# Altium schematic sheet CAN_TO_USART_V2.1.SchDoc
size A2
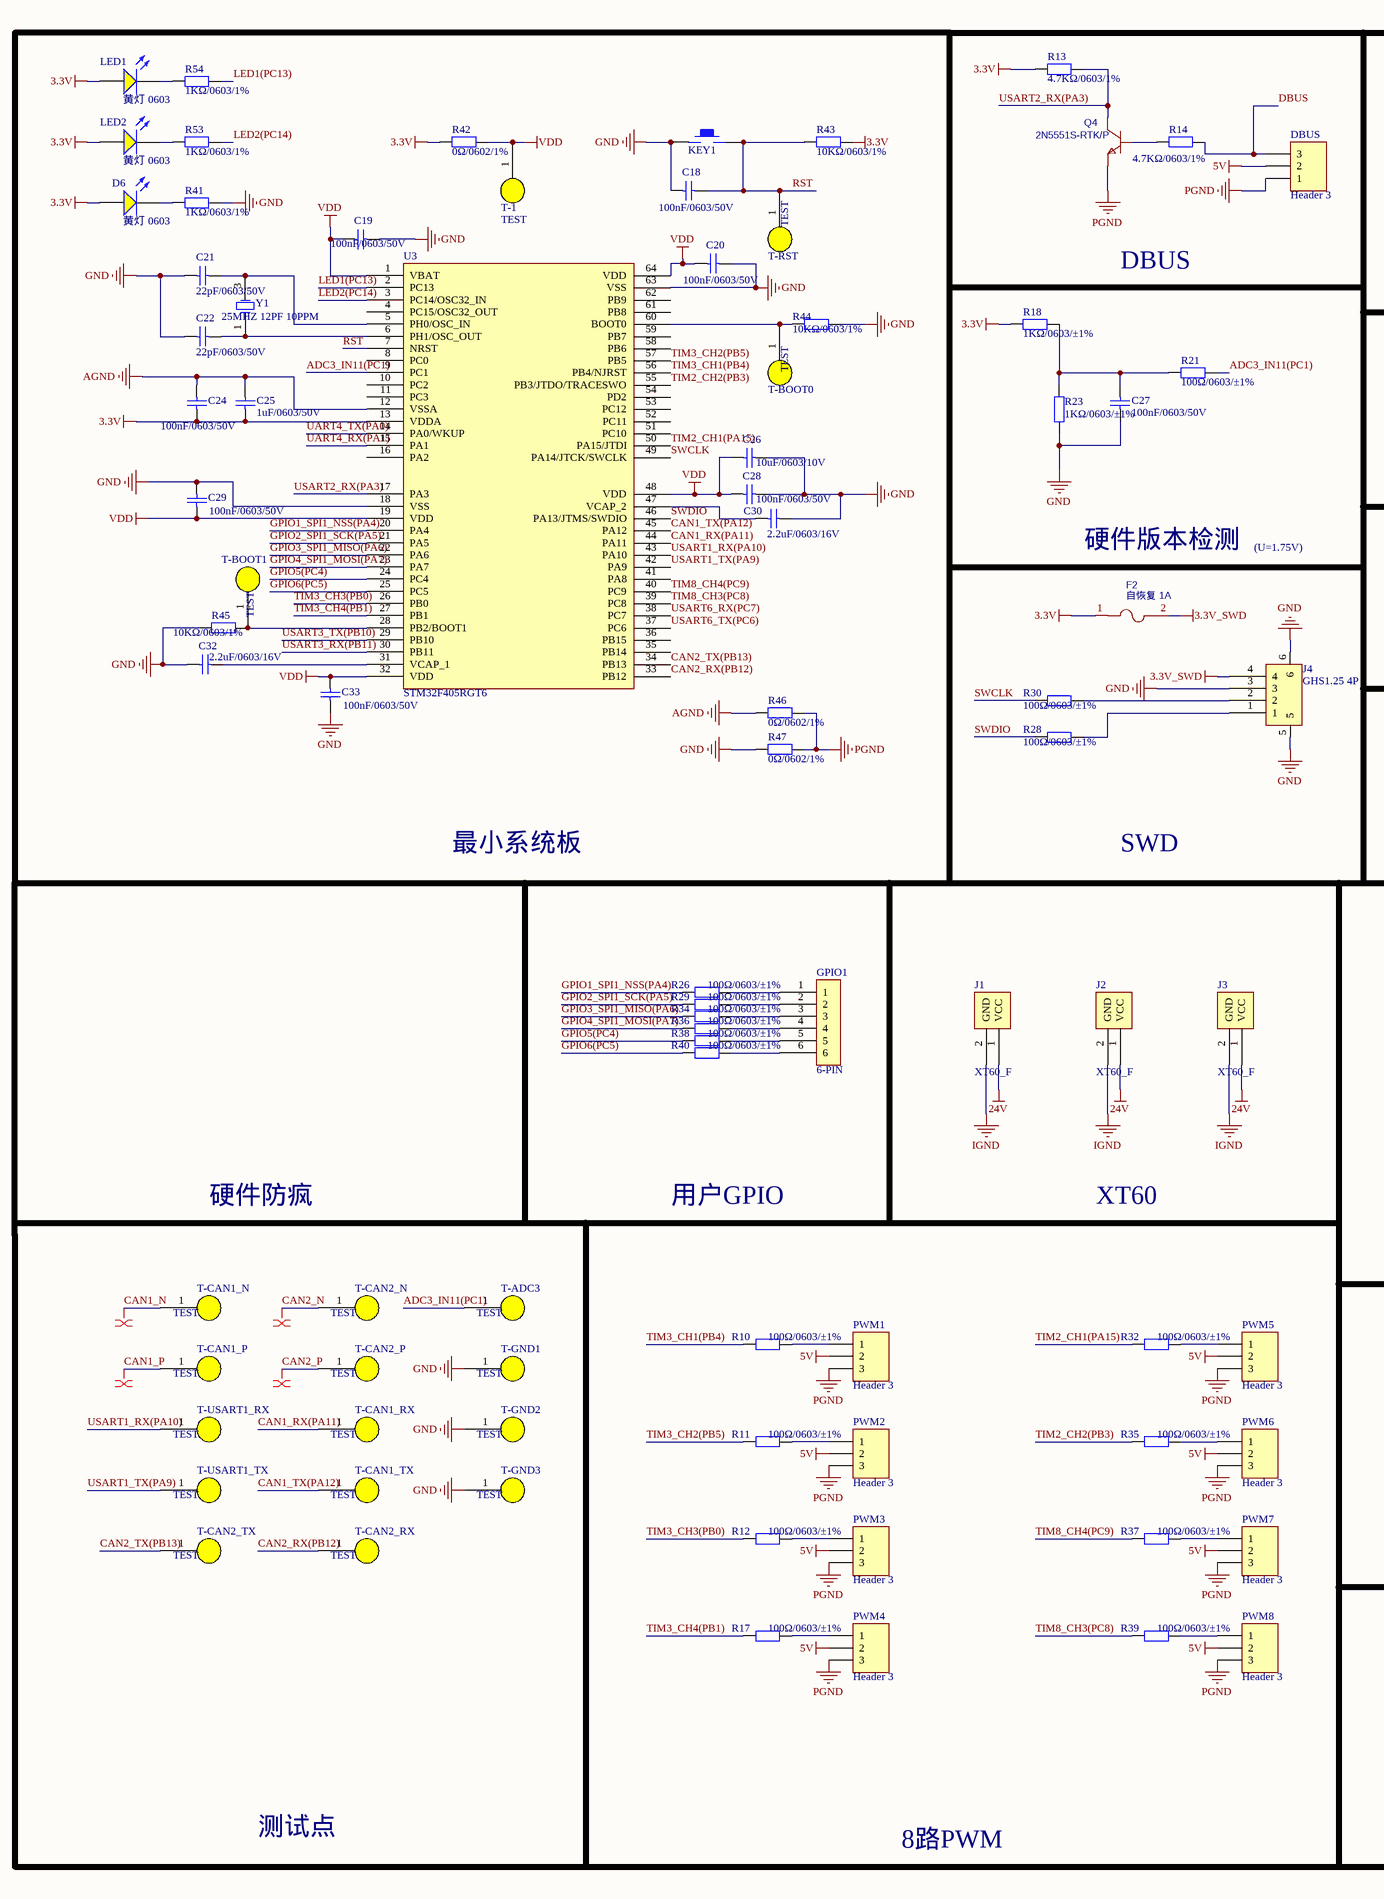
[diagram p0: CAN_TO_USART_V2.1.SchDoc, left]
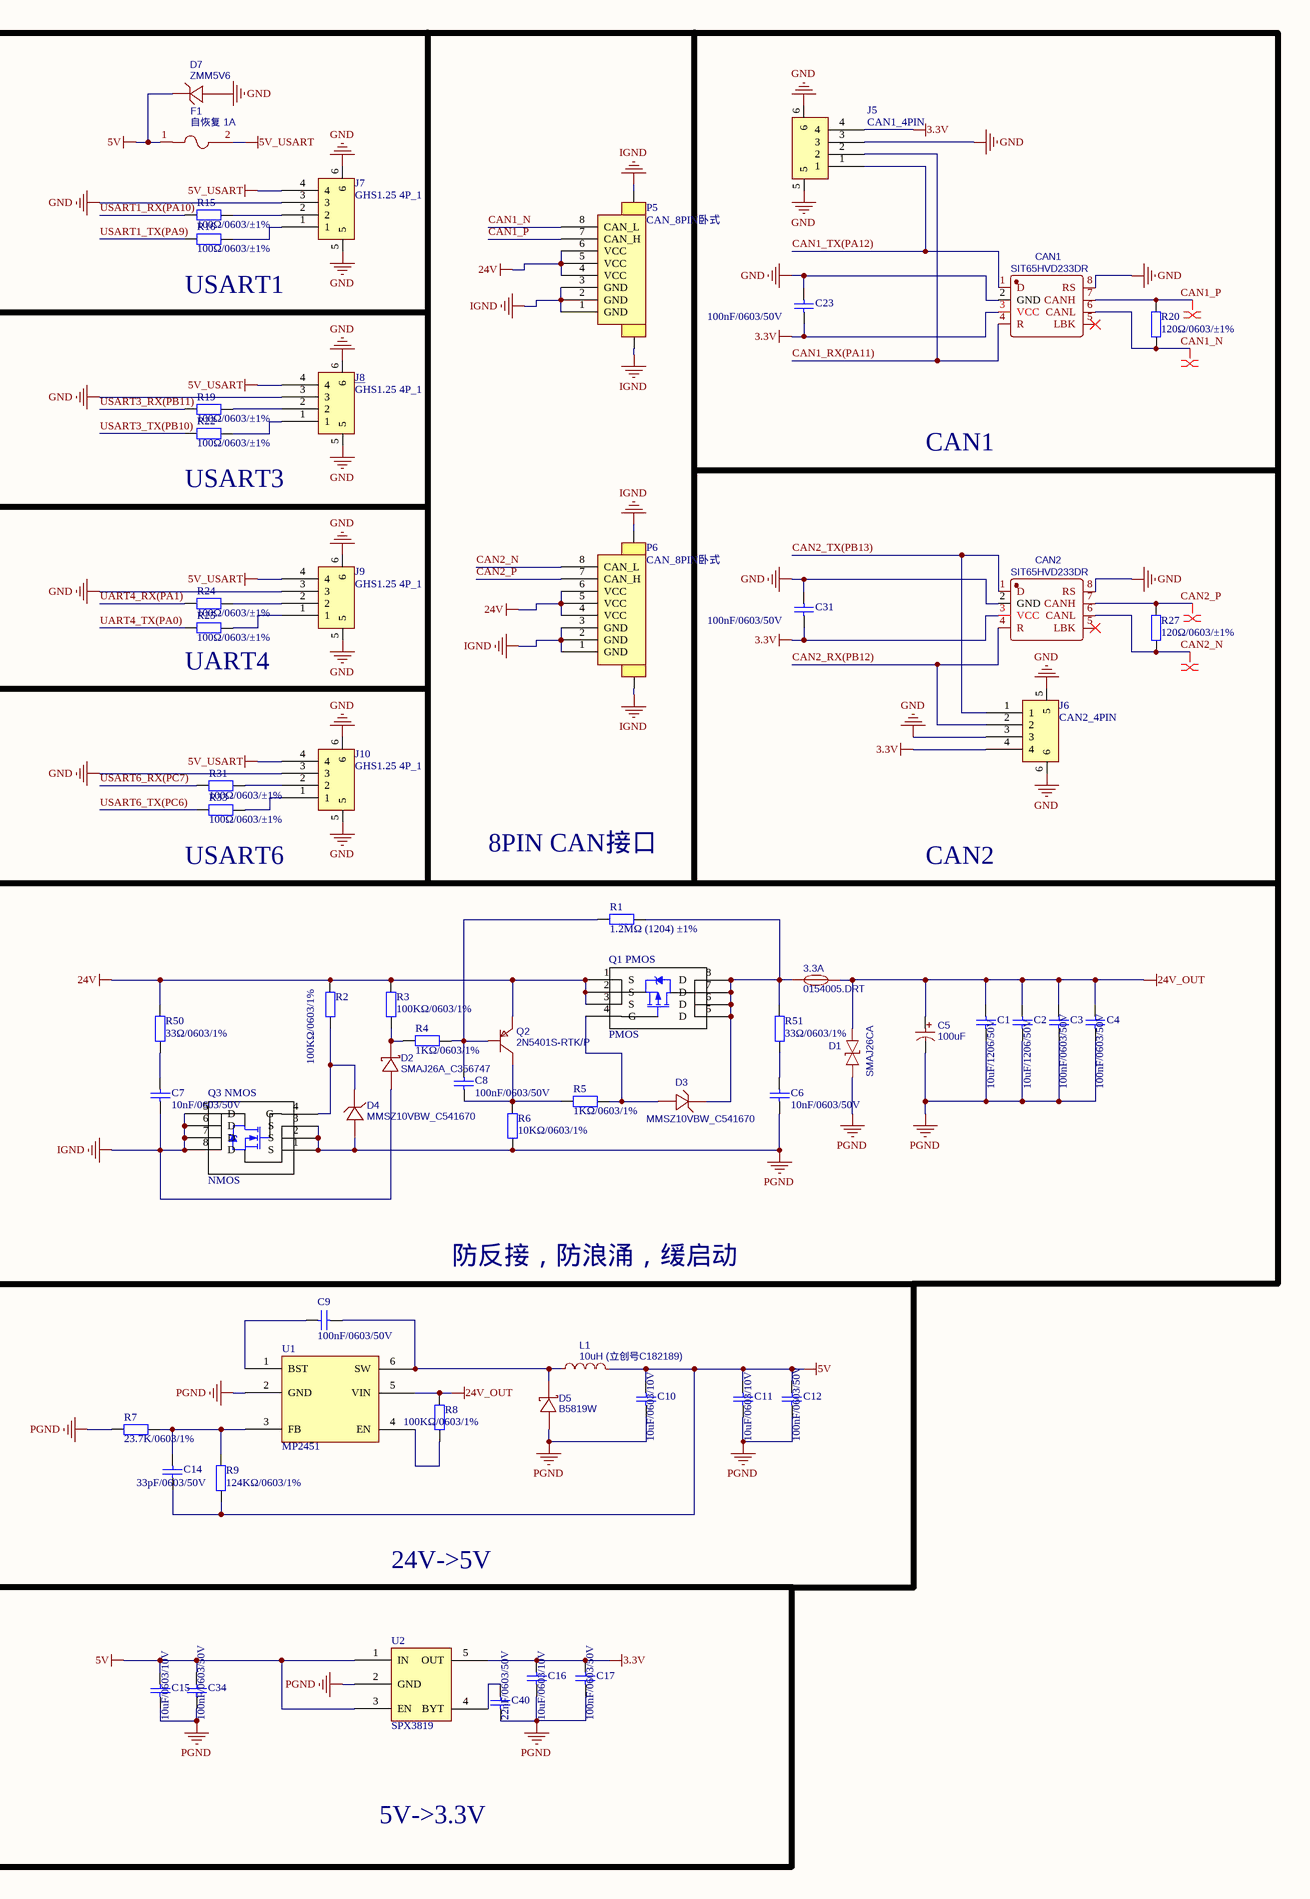
[diagram p1: CAN_TO_USART_V2.1.SchDoc, right]

## Parts
3.3A  0154005.DRT  [FUSE 3.3A]
C1  10uF/1206/50V  [1206_C]
C2  10uF/1206/50V  [1206_C]
C3  100nF/0603/50V  [0603_C]
C4  100nF/0603/50V  [0603_C]
C5  100uF  [100UF E]
C6  10nF/0603/50V  [0603_C]
C7  10nF/0603/50V  [0603_C]
C8  100nF/0603/50V  [0603_C]
C9  100nF/0603/50V  [0603_C]
C10  10uF/0603/10V  [0603_C]
C11  10uF/0603/10V  [0603_C]
C12  100nF/0603/50V  [0603_C]
C14  33pF/0603/50V  [0603_C]
C15  10uF/0603/10V  [0603_C]
C16  10uF/0603/10V  [0603_C]
C17  100nF/0603/50V  [0603_C]
C18  100nF/0603/50V  [0603_C]
C19  100nF/0603/50V  [0603_C]
C20  100nF/0603/50V  [0603_C]
C21  22pF/0603/50V  [0603_C]
C22  22pF/0603/50V  [0603_C]
C23  100nF/0603/50V  [0603_C]
C24  100nF/0603/50V  [0603_C]
C25  1uF/0603/50V  [0603_C]
C26  10uF/0603/10V  [0603_C]
C27  100nF/0603/50V  [0603_C]
C28  100nF/0603/50V  [0603_C]
C29  100nF/0603/50V  [0603_C]
C30  2.2uF/0603/16V  [0603_C]
C31  100nF/0603/50V  [0603_C]
C32  2.2uF/0603/16V  [0603_C]
C33  100nF/0603/50V  [0603_C]
C34  100nF/0603/50V  [0603_C]
C40  22nF/0603/50V  [0603_C]
CAN1  SIT65HVD233DR  [CAN-MCU]
CAN2  SIT65HVD233DR  [CAN-MCU]
D1  SMAJ26CA  [SMAJ26CA]
D2  SMAJ26A_C356747  [SMA_L4.4-W2.8-LS5.4-RD]
D3  MMSZ10VBW_C541670  [SOD-123_L2.7-W1.6-LS3.7-RD]
D4  MMSZ10VBW_C541670  [SOD-123_L2.7-W1.6-LS3.7-RD]
D5  B5819W  [SOD-123_L2.8-W1.8-LS3.7-RD]
D6  黄灯 0603  [0603_LED_S1]
D7  ZMM5V6  [ZMM5.6V]
DBUS  Header 3  [HDR1X3]
F1  自恢复 1A  [1A 0805]
F2  自恢复 1A  [1A 0805]
GPIO1  6-PIN  [6P]
J1  XT60_F  [XT60_F（立式）]
J2  XT60_F  [XT60_F（立式）]
J3  XT60_F  [XT60_F（立式）]
J4  GHS1.25 4P  [SM04B-GHS立式]
J5  CAN1_4PIN  [SM04B-GHS卧式]
J6  CAN2_4PIN  [SM04B-GHS卧式]
J7  GHS1.25 4P_1  [SM04B-GHS卧式]
J8  GHS1.25 4P_1  [SM04B-GHS卧式]
J9  GHS1.25 4P_1  [SM04B-GHS卧式]
J10  GHS1.25 4P_1  [SM04B-GHS卧式]
KEY1  KEY_M  [KEY]  (value not drawn)
L1  10uH (立创号C182189)  [10UH 1A]
LED1  黄灯 0603  [0603_LED_S1]
LED2  黄灯 0603  [0603_LED_S1]
P5  CAN_8PIN卧式  [8Pin]
P6  CAN_8PIN卧式  [8Pin]
PWM1  Header 3  [HDR1X3]
PWM2  Header 3  [HDR1X3]
PWM3  Header 3  [HDR1X3]
PWM4  Header 3  [HDR1X3]
PWM5  Header 3  [HDR1X3]
PWM6  Header 3  [HDR1X3]
PWM7  Header 3  [HDR1X3]
PWM8  Header 3  [HDR1X3]
Q1_PMOS  PMOS  [PMOS TCPA8123]
Q2  2N5401S-RTK/P  [SOT-23-3_L2.9-W1.6-P1.90-LS2.8-TR-CW]
Q3_NMOS  NMOS  [NMOS]
Q4  2N5551S-RTK/P  [SOT-23-3_L2.9-W1.6-P1.90-LS2.8-TR-CW]
R1  1.2MΩ (1204) ±1%  [0603_R]
R2  100KΩ/0603/1%  [0603_R]
R3  100KΩ/0603/1%  [0603_R]
R4  1KΩ/0603/1%  [0603_R]
R5  1KΩ/0603/1%  [0603_R]
R6  10KΩ/0603/1%  [0603_R]
R7  23.7K/0603/1%  [0603_R]
R8  100KΩ/0603/1%  [0603_R]
R9  124KΩ/0603/1%  [0603_R]
R10  100Ω/0603/±1%  [0603_R]
R11  100Ω/0603/±1%  [0603_R]
R12  100Ω/0603/±1%  [0603_R]
R13  4.7KΩ/0603/1%  [0603_R]
R14  4.7KΩ/0603/1%  [0603_R]
R15  100Ω/0603/±1%  [0603_R]
R16  100Ω/0603/±1%  [0603_R]
R17  100Ω/0603/±1%  [0603_R]
R18  1KΩ/0603/±1%  [0603_R]
R19  100Ω/0603/±1%  [0603_R]
R20  120Ω/0603/±1%  [0603_R]
R21  100Ω/0603/±1%  [0603_R]
R22  100Ω/0603/±1%  [0603_R]
R23  1KΩ/0603/±1%  [0603_R]
R24  100Ω/0603/±1%  [0603_R]
R25  100Ω/0603/±1%  [0603_R]
R26  100Ω/0603/±1%  [0603_R]
R27  120Ω/0603/±1%  [0603_R]
R28  100Ω/0603/±1%  [0603_R]
R29  100Ω/0603/±1%  [0603_R]
R30  100Ω/0603/±1%  [0603_R]
R31  100Ω/0603/±1%  [0603_R]
R32  100Ω/0603/±1%  [0603_R]
R33  100Ω/0603/±1%  [0603_R]
R34  100Ω/0603/±1%  [0603_R]
R35  100Ω/0603/±1%  [0603_R]
R36  100Ω/0603/±1%  [0603_R]
R37  100Ω/0603/±1%  [0603_R]
R38  100Ω/0603/±1%  [0603_R]
R39  100Ω/0603/±1%  [0603_R]
R40  100Ω/0603/±1%  [0603_R]
R41  1KΩ/0603/1%  [0603_R]
R42  0Ω/0602/1%  [0603_R]
R43  10KΩ/0603/1%  [0603_R]
R44  10KΩ/0603/1%  [0603_R]
R45  10KΩ/0603/1%  [0603_R]
R46  0Ω/0602/1%  [0603_R]
R47  0Ω/0602/1%  [0603_R]
R50  33Ω/0603/1%  [0603_R]
R51  33Ω/0603/1%  [0603_R]
R53  1KΩ/0603/1%  [0603_R]
R54  1KΩ/0603/1%  [0603_R]
T-1  TEST  [TEST-POINT]
T-ADC3  TEST  [TEST-POINT]
T-BOOT0  TEST  [TEST-POINT]
T-BOOT1  TEST  [TEST-POINT]
T-CAN1_N  TEST  [TEST-POINT]
T-CAN1_P  TEST  [TEST-POINT]
T-CAN1_RX  TEST  [TEST-POINT]
T-CAN1_TX  TEST  [TEST-POINT]
T-CAN2_N  TEST  [TEST-POINT]
T-CAN2_P  TEST  [TEST-POINT]
T-CAN2_RX  TEST  [TEST-POINT]
T-CAN2_TX  TEST  [TEST-POINT]
T-GND1  TEST  [TEST-POINT]
T-GND2  TEST  [TEST-POINT]
T-GND3  TEST  [TEST-POINT]
T-RST  TEST  [TEST-POINT]
T-USART1_RX  TEST  [TEST-POINT]
T-USART1_TX  TEST  [TEST-POINT]
U1  MP2451  [MP2451]
U2  SPX3819  [SPX3819]
U3  STM32F405RGT6  [STM32F405RGT6]
Y1  25MHZ 12PF 10PPM  [SMD-3225_4P]

## Blocks framed on the sheet
最小系统板: C18-C22 C24-C26 C28-C30 C32 C33 D6 KEY1 LED1 LED2 R41-R47 R53 R54 T-1 T-BOOT0 T-BOOT1 T-RST U3 Y1

## Nets
3.3V: C16.2 C17.2 C23.1 C24.1 C25.2 C31.1 CAN1.3(VCC) CAN2.3(VCC) D6.A F2.1 J5.4 J6.4 LED1.A LED2.A R13.1 R18.2 R42.1 R43.2 U2.5(OUT) U3.13(VDDA)
3.3V_SWD: F2.2 J4.4
5V: C10.2 C11.2 C12.2 C14.1 C15.1 C34.2 D7.1(C) DBUS.2 F1.1 L1.2 PWM1.2 PWM2.2 PWM3.2 PWM4.2 PWM5.2 PWM6.2 PWM7.2 PWM8.2 R9.1 U2.1(IN) U2.3(EN)
5V_USART: F1.2 J7.4 J8.4 J9.4 J10.4
24V: J1.1(VCC) J2.1(VCC) J3.1(VCC) P5.4(VCC) P5.5(VCC) P5.6(VCC) P6.4(VCC) P6.5(VCC) P6.6(VCC) Q1_PMOS.1(S) Q1_PMOS.2(S) Q1_PMOS.3(S) Q2.1(E) R2.2 R3.1 R50.2
24V_OUT: 3.3A.1 C1.2 C2.2 C3.1 C4.1 C5.1 D1.2 R8.2 U1.5(VIN)
AGND: C24.2 C25.1 R46.1 U3.12(VSSA)
GND: C18.2 C19.1 C20.1 C21.1 C22.1 C23.2 C26.2 C27.1 C28.1 C29.2 C30.2 C31.2 C32.1 C33.1 CAN1.2(GND) CAN1.8(RS) CAN2.2(GND) CAN2.8(RS) D7.2(A) J4.3 J4.5 J4.6 J5.3 J5.5 J5.6 J6.3 J6.5 J6.6 J7.3 J7.5 J7.6 J8.3 J8.5 J8.6 J9.3 J9.5 J9.6 J10.3 J10.5 J10.6 KEY1.1 R23.1 R41.2 R44.2 R45.1 R47.1 T-GND1.1 T-GND2.1 T-GND3.1 U3.18(VSS) U3.63(VSS)
IGND: C7.1 D2.2(A) J1.2(GND) J2.2(GND) J3.2(GND) P5.1(GND) P5.2(GND) P5.3(GND) P5.9(GND) P5.10(GND) P6.1(GND) P6.2(GND) P6.3(GND) P6.9(GND) P6.10(GND) Q3_NMOS.5(D) Q3_NMOS.6(D) Q3_NMOS.7(D) Q3_NMOS.8(D)
PGND: C1.1 C2.1 C3.2 C4.2 C5.2 C6.1 C10.1 C11.1 C12.1 C15.2 C16.1 C17.1 C34.1 C40.2 D1.1 D4.2(A) D5.2(A) DBUS.1 PWM1.3 PWM2.3 PWM3.3 PWM4.3 PWM5.3 PWM6.3 PWM7.3 PWM8.3 Q3_NMOS.1(S) Q3_NMOS.2(S) Q3_NMOS.3(S) Q4.1(E) R6.1 R7.1 R46.2 R47.2 U1.2(GND) U2.2(GND)
VDD: C19.2 C20.2 C26.1 C28.2 C29.1 C33.2 R42.2 T-1.1 U3.1(VBAT) U3.19(VDD) U3.32(VDD) U3.48(VDD) U3.64(VDD)
ADC3_IN11(PC1): R21.2 T-ADC3.1 U3.9(PC1)
CAN1_N: CAN1.6(CANL) P5.8(CAN_L) R20.1 T-CAN1_N.1
CAN1_P: CAN1.7(CANH) P5.7(CAN_H) R20.2 T-CAN1_P.1
CAN1_RX(PA11): CAN1.4(R) J5.2 T-CAN1_RX.1 U3.44(PA11)
CAN1_TX(PA12): CAN1.1(D) J5.1 T-CAN1_TX.1 U3.45(PA12)
CAN2_N: CAN2.6(CANL) P6.8(CAN_L) R27.1 T-CAN2_N.1
CAN2_P: CAN2.7(CANH) P6.7(CAN_H) R27.2 T-CAN2_P.1
CAN2_RX(PB12): CAN2.4(R) J6.2 T-CAN2_RX.1 U3.33(PB12)
CAN2_TX(PB13): CAN2.1(D) J6.1 T-CAN2_TX.1 U3.34(PB13)
DBUS: DBUS.3 R14.2
GPIO1_SPI1_NSS(PA4): R26.1 U3.20(PA4)
GPIO2_SPI1_SCK(PA5): R29.1 U3.21(PA5)
GPIO3_SPI1_MISO(PA6): R34.1 U3.22(PA6)
GPIO4_SPI1_MOSI(PA7): R36.1 U3.23(PA7)
GPIO5(PC4): R38.1 U3.24(PC4)
GPIO6(PC5): R40.1 U3.25(PC5)
LED1(PC13): R54.2 U3.2(PC13)
LED2(PC14): R53.2 U3.3(PC14/OSC32_IN)
RST: C18.1 KEY1.2 R43.1 T-RST.1 U3.7(NRST)
SWCLK: R30.1 U3.49(PA14/JTCK/SWCLK)
SWDIO: R28.1 U3.46(PA13/JTMS/SWDIO)
TIM2_CH1(PA15): R32.1 U3.50(PA15/JTDI)
TIM2_CH2(PB3): R35.1 U3.55(PB3/JTDO/TRACESWO)
TIM3_CH1(PB4): R10.1 U3.56(PB4/NJRST)
TIM3_CH2(PB5): R11.1 U3.57(PB5)
TIM3_CH3(PB0): R12.1 U3.26(PB0)
TIM3_CH4(PB1): R17.1 U3.27(PB1)
TIM8_CH3(PC8): R39.1 U3.39(PC8)
TIM8_CH4(PC9): R37.1 U3.40(PC9)
UART4_RX(PA1): R24.1 U3.15(PA1)
UART4_TX(PA0): R25.1 U3.14(PA0/WKUP)
USART1_RX(PA10): R15.1 T-USART1_RX.1 U3.43(PA10)
USART1_TX(PA9): R16.1 T-USART1_TX.1 U3.42(PA9)
USART2_RX(PA3): Q4.3(C) R13.2 U3.17(PA3)
USART3_RX(PB11): R19.1 U3.30(PB11)
USART3_TX(PB10): R22.1 U3.29(PB10)
USART6_RX(PC7): R31.1 U3.38(PC7)
USART6_TX(PC6): R33.1 U3.37(PC6)
Net3.3A_2: 3.3A.2 D3.1(C) Q1_PMOS.5(D) Q1_PMOS.6(D) Q1_PMOS.7(D) Q1_PMOS.8(D) R1.2 R51.2
NetC6_2: C6.2 R51.1
NetC7_2: C7.2 R50.1
NetC8_1: C8.1 Q2.3(C) R5.1 R6.2
NetC8_2: C8.2 Q2.2(B) R1.1 R4.2
NetC9_1: C9.1 D5.1(K) L1.1 U1.6(SW)
NetC9_2: C9.2 U1.1(BST)
NetC14_2: C14.2 R7.2 R9.2 U1.3(FB)
NetC21_2: C21.2 U3.5(PH0/OSC_IN) Y1.3(OSC2)
NetC22_2: C22.2 U3.6(PH1/OSC_OUT) Y1.1(OSC1)
NetC27_2: C27.2 R18.1 R21.1 R23.2
NetC30_1: C30.1 U3.47(VCAP_2)
NetC32_2: C32.2 U3.31(VCAP_1)
NetC40_1: C40.1 U2.4(BYT)
NetD2_1: D2.1(K) R3.2 R4.1
NetD3_2: D3.2(A) Q1_PMOS.4(G) R5.2
NetD4_1: D4.1(C) Q3_NMOS.4(G) R2.1
NetD6_K: D6.K R41.1
NetGPIO1_1: GPIO1.1 R26.2
NetGPIO1_2: GPIO1.2 R29.2
NetGPIO1_3: GPIO1.3 R34.2
NetGPIO1_4: GPIO1.4 R36.2
NetGPIO1_5: GPIO1.5 R38.2
NetGPIO1_6: GPIO1.6 R40.2
NetJ4_1: J4.1 R28.2
NetJ4_2: J4.2 R30.2
NetJ7_1: J7.1 R16.2
NetJ7_2: J7.2 R15.2
NetJ8_1: J8.1 R22.2
NetJ8_2: J8.2 R19.2
NetJ9_1: J9.1 R25.2
NetJ9_2: J9.2 R24.2
NetJ10_1: J10.1 R33.2
NetJ10_2: J10.2 R31.2
NetLED1_K: LED1.K R54.1
NetLED2_K: LED2.K R53.1
NetPWM1_1: PWM1.1 R10.2
NetPWM2_1: PWM2.1 R11.2
NetPWM3_1: PWM3.1 R12.2
NetPWM4_1: PWM4.1 R17.2
NetPWM5_1: PWM5.1 R32.2
NetPWM6_1: PWM6.1 R35.2
NetPWM7_1: PWM7.1 R37.2
NetPWM8_1: PWM8.1 R39.2
NetQ4_2: Q4.2(B) R14.1
NetR8_1: R8.1 U1.4(EN)
NetR44_1: R44.1 T-BOOT0.1 U3.60(BOOT0)
NetR45_2: R45.2 T-BOOT1.1 U3.28(PB2/BOOT1)

Not connected (* = marked no-connect by the designer): CAN1 5(LBK)*; CAN2 5(LBK)*; U3 4(PC15/OSC32_OUT) 8(PC0) 10(PC2) 11(PC3) 16(PA2) 35(PB14) 36(PB15) 41(PA8) 51(PC10) 52(PC11) 53(PC12) 54(PD2) 58(PB6) 59(PB7) 61(PB8) 62(PB9)

## Layout directives
differential pair: CAN1_N, CAN1_P, CAN2_N, CAN2_P

## Notes on the sheet
- DBUS
- (near R16) USART1
- CAN1
- (near R22) USART3
- 硬件版本检测
- (U=1.75V)
- (near R25) UART4
- SWD
- (near R33) USART6
- 8PIN CAN接口
- CAN2
- 硬件防疯
- 用户GPIO
- XT60
- 防反接，防浪涌，缓启动
- 24V->5V
- 测试点
- 8路PWM
- 5V->3.3V

## Library data of the parts
3.3A = 0154005.DRT: BOM_Manufacturer: Littelfuse; Contributor: LCSC; BOM_Supplier: LCSC; BOM_Supplier Part: C206917; BOM_Manufacturer Part: 0154005.DRT; spicePre: U; spiceSymbolName: 0154005.DRT
C1 C2 = 1206 10uF (106) 10% 50V: 贴片电容; ComponentLink1Description: 供应商链接; ComponentLink1URL: http://www.szlcsc.com/product/details_14236.html; Package: 1206; Supplier: LC; SuppliersPartNumber: C13585
C3 C4 C8 C9 C12 C17-C20 C23 C24 C27-C29 C31 C33 C34 = 0603 100nF (104) 10% 50V: 贴片电容; ComponentLink1Description: 供应商链接; ComponentLink1URL: http://www.szlcsc.com/product/details_15331.html; Package: 0603; Supplier: LC; SuppliersPartNumber: C14663
C5 = 100uF: BOM_Manufacturer: ValuePro; BOM_Manufacturer Part: 50V 100uF 8X12; nameAlias: Capacitance; BOM_Supplier: LCSC; BOM_Supplier Part: C2749; spicePre: C; spiceSymbolName: 50V 100uF 8X12
C6 C7 = 0603 10nF (103) 10% 50V: 贴片电容; ComponentLink1Description: 供应商链接; ComponentLink1URL: http://www.szlcsc.com/product/details_58143.html; Package: 0603; Supplier: LC; SuppliersPartNumber: C57112
C10 C11 C15 C16 C26 = 0603 10uF (106) 10% 10V: 贴片电容; ComponentLink1Description: 供应商链接; ComponentLink1URL: http://www.szlcsc.com/product/details_20411.html; Package: 0603; Supplier: LC; SuppliersPartNumber: C19702
C14 = 0603 33pF (330) 5% 50V: 贴片电容; ComponentLink1Description: 供应商链接; ComponentLink1URL: http://www.szlcsc.com/product/details_2015.html; Package: 0603; Supplier: LC; SuppliersPartNumber: C1663
C21 C22 = 0603 22pF (220) 5% 50V: 贴片电容; ComponentLink1Description: 供应商链接; ComponentLink1URL: http://www.szlcsc.com/product/details_2005.html; Package: 0603; Supplier: LC; SuppliersPartNumber: C1653
C25 = 0603 1uF (105) 10% 50V: 贴片电容; ComponentLink1Description: 供应商链接; ComponentLink1URL: http://www.szlcsc.com/product/details_16531.html; Package: 0603; Supplier: LC; SuppliersPartNumber: C15849
C30 C32 = 0603 2.2uF (225) 10% 16V: 贴片电容; ComponentLink1Description: 供应商链接; ComponentLink1URL: http://www.szlcsc.com/product/details_24366.html; Package: 0603; Supplier: LC; SuppliersPartNumber: C23630
C40 = 0603 22nF (223) 10% 50V: 贴片电容; ComponentLink1Description: 供应商链接; ComponentLink1URL: http://www.szlcsc.com/product/details_21834.html; Package: 0603; Supplier: LC; SuppliersPartNumber: C21122
CAN1 CAN2 = SIT65HVD233DR: BOM_Manufacturer: SIT; Contributor: LCSC; BOM_Supplier: LCSC; BOM_Supplier Part: C496620; BOM_Manufacturer Part: SIT65HVD233DR; spicePre: U; spiceSymbolName: SIT65HVD233DR
D1 = SMAJ26CA_C353459: BOM_Manufacturer: Shandong Jingdao Microelectronics; Contributor: LCSC; BOM_Supplier: LCSC; BOM_Supplier Part: C353459; BOM_Manufacturer Part: SMAJ26CA; spicePre: D; spiceSymbolName: SMAJ26CA_C353459
D2 = SMAJ26A_C356747: BOM_Manufacturer: Jiangsu JieJie Microelectronics; Contributor: LCSC; BOM_Supplier: LCSC; BOM_Supplier Part: C356747; BOM_Manufacturer Part: SMAJ26A; spicePre: D; spiceSymbolName: SMAJ26A_C356747
D3 D4 = MMSZ10VBW_C541670: BOM_Manufacturer: AnBon; Contributor: LCSC; BOM_Supplier: LCSC; BOM_Supplier Part: C541670; BOM_Manufacturer Part: MMSZ10VBW; spicePre: D; spiceSymbolName: MMSZ10VBW_C541670
D5 = B5819W: BOM_Manufacturer: MDD; SMT Type: Extend; BOM_Supplier: LCSC; BOM_Manufacturer Part: B5819W; image: //image.lceda.cn/szlcsc/C64885.jpg; BOM_Supplier Part: C64885; BOM_LCSC Assembly: Yes; spicePre: D; spiceSymbolName: B5819W
D6 LED1 LED2 = 0603 黄灯: 发光二极管; ComponentLink1Description: 供应商链接; ComponentLink1URL: http://www.szlcsc.com/product/details_73147.html; Package: 0603; Supplier: LC; SuppliersPartNumber: C72038
D7 = ZMM5V6: BOM_Manufacturer: SEMTECH; SMT Type: Basic; BOM_Supplier: LCSC; BOM_Manufacturer Part: ZMM5V6; image: //image.lceda.cn/szlcsc/C8062.jpg; BOM_Supplier Part: C8062; BOM_JLCPCB SMD: Yes; spicePre: D; spiceSymbolName: ZMM5V6
DBUS PWM1-PWM8 = Header 3: Header, 3-Pin; LatestRevisionDate: 17-Jul-2002; LatestRevisionNote: Re-released for DXP Platform.; Publisher: Altium Limited
F1 F2 = ASMD1206-100: BOM_Manufacturer: JDTFUSE; Contributor: LCSC; BOM_Supplier: LCSC; BOM_Manufacturer Part: ASMD1206-100; BOM_Supplier Part: C135340; spicePre: F; spiceSymbolName: ASMD1206-100
J4 = GHS1.25 4P: 立式
J5-J10 = GHS1.25 4P_1: 卧式短边
L1 = 10uH: BOM_Manufacturer: Sunltech Tech; BOM_Manufacturer Part: SLW5040S100MST; nameAlias: Inductance; Contributor: LCSC; BOM_Supplier: LCSC; BOM_Supplier Part: C182189; spicePre: L; spiceSymbolName: SLW5040S100MST
P5 P6 = CAN_8PIN: 卧式
Q1_PMOS = PMOS 8PIN: Note: Pin 4 not drawn and electrically connected to Pin 2.; Published: 8-Jun-2000; LatestRevisionDate: 17-Jul-2002; LatestRevisionNote: Re-released for DXP Platform.; DatasheetVersion: PD-9.390D; PackageVersion: Feb-1997; PackageReference: TO-220AB; Publisher: Altium Limited; PackageDescription: TO, Thru-Hole, Vertical, Heatsink Mounted; 3 In-Line Leads; Pitch 2.54 mm; ComponentLink1Description: Manufacturer Link; ComponentLink1URL: http://www.irf.com/
Q2 = 2N5401S-RTK/P: BOM_Manufacturer: KEC; Contributor: LCSC; SMT Type: Extend; BOM_Supplier: LCSC; BOM_Manufacturer Part: 2N5401S-RTK/P; BOM_Supplier Part: C147293; BOM_JLCPCB SMD: Yes; spicePre: Q; spiceSymbolName: 2N5401S-RTK/P
Q3_NMOS = NMOS 8PIN: Note: Pin 2 is electrically connected to pin 4.; Published: 8-Jun-2000; LatestRevisionDate: 17-Jul-2002; LatestRevisionNote: Re-released for DXP Platform.; DatasheetVersion: PD-9.814; PackageVersion: Feb-1997; PackageReference: TO-220AB; Publisher: Altium Limited; PackageDescription: TO, Thru-Hole, Vertical, Heatsink Mounted; 3 In-Line Leads; Pitch 2.54 mm; ComponentLink1Description: Manufacturer Link; ComponentLink1URL: http://www.irf.com/
Q4 = 2N5551S-RTK/P: BOM_Manufacturer: KEC; Contributor: LCSC; SMT Type: Extend; BOM_Supplier: LCSC; BOM_Manufacturer Part: 2N5551S-RTK/P; BOM_Supplier Part: C112669; BOM_LCSC Assembly: Yes; spicePre: Q; spiceSymbolName: 2N5551S-RTK/P
R1 = 0603 1.2MΩ (1204) 1%: 贴片电阻; ComponentLink1Description: 供应商链接; ComponentLink1URL: http://www.szlcsc.com/product/details_23493.html; Package: 0603; Supplier: LC; SuppliersPartNumber: C22766
R2 R3 R8 = 0603 100KΩ (1003) 1%: 贴片电阻; ComponentLink1Description: 供应商链接; ComponentLink1URL: http://www.szlcsc.com/product/details_26546.html; Package: 0603; Supplier: LC; SuppliersPartNumber: C25803
R4 R5 R23 R41 R53 R54 = 0603 1KΩ (1001) 1%: 贴片电阻; ComponentLink1Description: 供应商链接; ComponentLink1URL: http://www.szlcsc.com/product/details_21904.html; Package: 0603; Supplier: LC; SuppliersPartNumber: C21190
R6 R43-R45 = 0603 10KΩ (1002) 1%: 贴片电阻; ComponentLink1Description: 供应商链接; ComponentLink1URL: http://www.szlcsc.com/product/details_26547.html; Package: 0603; Supplier: LC; SuppliersPartNumber: C25804
R7 R9 = 0603 3KΩ (3001) 1%: 贴片电阻; ComponentLink1Description: 供应商链接; ComponentLink1URL: http://www.szlcsc.com/product/details_4618.html; Package: 0603; Supplier: LC; SuppliersPartNumber: C4211
R10-R12 R15-R17 R19 R21 R22 R24-R26 R28-R40 = 0603 100Ω (1000) 1%: 贴片电阻; ComponentLink1Description: 供应商链接; ComponentLink1URL: http://www.szlcsc.com/product/details_23502.html; Package: 0603; Supplier: LC; SuppliersPartNumber: C22775
R13 R14 = 0603 4.7KΩ (4701) 1%: 贴片电阻; ComponentLink1Description: 供应商链接; ComponentLink1URL: http://www.szlcsc.com/product/details_23889.html; Package: 0603; Supplier: LC; SuppliersPartNumber: C23162
R18 = 0603 1MΩ (1004) 1%: 贴片电阻; ComponentLink1Description: 供应商链接; ComponentLink1URL: http://www.szlcsc.com/product/details_23662.html; Package: 0603; Supplier: LC; SuppliersPartNumber: C22935
R20 R27 = 0603 120Ω (1200) 1%: 贴片电阻; ComponentLink1Description: 供应商链接; ComponentLink1URL: http://www.szlcsc.com/product/details_23514.html; Package: 0603; Supplier: LC; SuppliersPartNumber: C22787
R42 R46 R47 = 0603 0Ω (0R0) 1%: 贴片电阻; ComponentLink1Description: 供应商链接; ComponentLink1URL: http://www.szlcsc.com/product/details_21903.html; Package: 0603; Supplier: LC; SuppliersPartNumber: C21189
R50 R51 = 0603 33Ω (33R0) 1%: 贴片电阻; ComponentLink1Description: 供应商链接; ComponentLink1URL: http://www.szlcsc.com/product/details_23867.html; Package: 0603; Supplier: LC; SuppliersPartNumber: C23140
Y1 = SMD-3225_4P  25MHZ 12PF 10PPM: 贴片晶振; ComponentLink1Description: 供应商链接; ComponentLink1URL: http://www.szlcsc.com/product/details_9526.html; Package: SMD-3225_4P; Supplier: LC; SuppliersPartNumber: C9006